# Altium schematic sheet LoRa-module.SchDoc
size A4; SheetNumber: 3; SheetTotal: 5
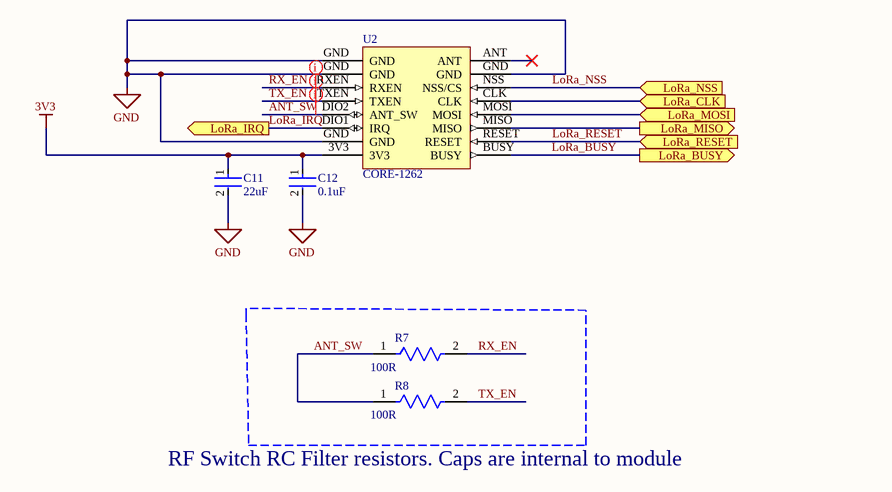
[diagram p0: LoRa-module.SchDoc]

## Parts
C11  22uF  [FP-GRM21B-0_15-MFG]
C12  0.1uF  [FP-GCM21B-0_15-MFG]
R7  Resistance: 100R  [FP-RMCF0805-IPC_A]  (hidden comment: RMCF0805FT100R)
R8  Resistance: 100R  [FP-RMCF0805-IPC_A]  (hidden comment: RMCF0805FT100R)
U2  CORE-1262  [WAVE-20855-Core1262]

## Ports
LoRa_BUSY (out), LoRa_CLK (in), LoRa_IRQ (out), LoRa_MISO (out), LoRa_MOSI (in), LoRa_NSS (in), LoRa_RESET (in)

## Nets
3V3: C11.1 C12.1 U2.3V3
GND: C11.2 C12.2 U2.GND
ANT_SW: R7.1 R8.1 U2.DIO2(ANT_SW)
LoRa_BUSY: U2.BUSY ; port LoRa_BUSY
LoRa_CLK: U2.CLK ; port LoRa_CLK
LoRa_IRQ: U2.DIO1(IRQ) ; port LoRa_IRQ
LoRa_MISO: U2.MISO ; port LoRa_MISO
LoRa_MOSI: U2.MOSI ; port LoRa_MOSI
LoRa_NSS: U2.NSS(NSS/CS) ; port LoRa_NSS
LoRa_RESET: U2.RESET ; port LoRa_RESET
RX_EN: R7.2 U2.RXEN
TX_EN: R8.2 U2.TXEN

Not connected (* = marked no-connect by the designer): U2 ANT*

## Layout directives
net class DIGITAL: ANT_SW, RX_EN, TX_EN

## Notes on the sheet
- (near R8) RF Switch RC Filter resistors. Caps are internal to module

## Library data of the parts
C11 = CMP-2007-03385-2: Chip Multilayer Ceramic Capacitors for General Purpose, 0805, 22uF, X5R, 15%, 20%, 6.3V; Material: Ceramic; Max Operating Temperature: 85°C; Voltage: 6.3V; Min Operating Temperature: -55°C; Case/Package: 0805; Thickness: 0.053inch; Dielectric: X5R; Packaging: Tape and Reel; Depth: 1.25mm; Termination: SMD/SMT; Voltage Rating (DC): 6.3V; Radiation Hardening: No; Tolerance: 20%; Mount: Surface Mount; Lead Free: Lead Free; Package Quantity: 1; REACH SVHC: No SVHC; Voltage Rating: 6.3V; Capacitance: 22uF; Length: 2mm; Case Code (Imperial): 0805; Case Code (Metric): 2012; Width: 0.049inch; Height: 1.25mm
C12 = CMP-2007-03364-2: Ceramic Capacitor for Automotive 100nF ±10% 100VDC X7R 0805 Embossed T/R; Voltage Rating: 100V; Termination: SMD/SMT; Tolerance: 10%; Case Code (Imperial): 0805; Length: 2mm; Max Operating Temperature: 125°C; Case/Package: 0805; Mount: Surface Mount; Packaging: Tape and Reel; Package Quantity: 1; Min Operating Temperature: -55°C; Case Code (Metric): 2012; Radiation Hardening: No; REACH SVHC: No SVHC; Dielectric: X7R; Depth: 1.25mm; Lead Free: Lead Free; Ratings: AEC-Q200; Height: 1.25mm; Voltage: 100V; Capacitance: 100nF; Voltage Rating (DC): 100V; Width: 0.049inch; Thickness: 0.055inch
R7 R8 = CMP-26527-001731-1: 100Ω ±1% 0.125W 0805 Thick Film Chip Resistor AEC-Q200 compliant; Power Rating: 250mW; Temperature Coefficient: 100ppm/°C; Max Power Dissipation: 125mW; Radiation Hardening: No; RoHS Compliant: Yes; Case Code (Imperial): 0805; Depth: 1.25mm; Length: 2mm; Min Operating Temperature: -55°C; Series: RMCF; Packaging: Tape and Reel; Features: Automotive AEC-Q200; Height: 0.026inch; Size Code: 0805; Tolerance: 1%; Number of Terminations: 2; Max Operating Temperature: 155°C; Case/Package: 0805; Width: 0.049inch; Contact Plating: Tin; Resistor Type: Thick Film; Construction: Rectangular; Lead Free: Lead Free; Military Standard: Not; Case Code (Metric): 2012; Mount: Surface Mount
U2 = CORE-1262: LoRa HF module